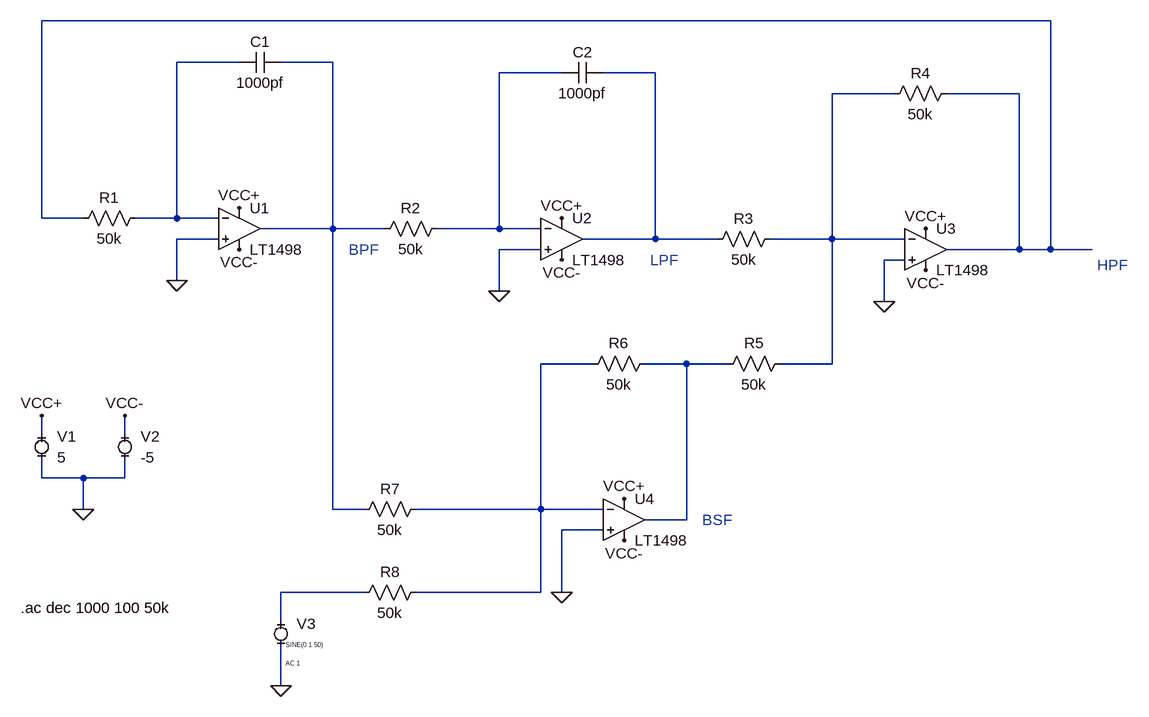
[diagram p0: schematic UniversalAmplifier.asc]
UniversalAmplifier.asc, the LTspice schematic file:
Version 4
SHEET 1 1160 1352
WIRE 1040 160 -512 160
WIRE -208 224 -304 224
WIRE -64 224 -144 224
WIRE 288 240 192 240
WIRE 432 240 352 240
WIRE 800 272 704 272
WIRE 992 272 880 272
WIRE -512 464 -512 160
WIRE -448 464 -512 464
WIRE -304 464 -304 224
WIRE -304 464 -368 464
WIRE -240 464 -304 464
WIRE -64 480 -64 224
WIRE -64 480 -176 480
WIRE 16 480 -64 480
WIRE 192 480 192 240
WIRE 192 480 96 480
WIRE 256 480 192 480
WIRE -240 496 -304 496
WIRE 432 496 432 240
WIRE 432 496 320 496
WIRE 528 496 432 496
WIRE 704 496 704 272
WIRE 704 496 608 496
WIRE 816 496 704 496
WIRE 256 512 192 512
WIRE 992 512 992 272
WIRE 992 512 880 512
WIRE 1040 512 1040 160
WIRE 1040 512 992 512
WIRE 1104 512 1040 512
WIRE 816 528 784 528
WIRE -304 560 -304 496
WIRE 192 576 192 512
WIRE 784 592 784 528
WIRE 336 688 256 688
WIRE 480 688 416 688
WIRE 544 688 480 688
WIRE 704 688 704 496
WIRE 704 688 624 688
WIRE -512 800 -512 768
WIRE -384 800 -384 768
WIRE -512 864 -512 832
WIRE -448 864 -512 864
WIRE -384 864 -384 832
WIRE -384 864 -448 864
WIRE -448 912 -448 864
WIRE -64 912 -64 480
WIRE -16 912 -64 912
WIRE 256 912 256 688
WIRE 256 912 64 912
WIRE 352 912 256 912
WIRE 480 928 480 688
WIRE 480 928 416 928
WIRE 352 944 288 944
WIRE -16 1040 -144 1040
WIRE 256 1040 256 912
WIRE 256 1040 64 1040
WIRE 288 1040 288 944
WIRE -144 1088 -144 1040
WIRE -144 1184 -144 1120
FLAG -304 560 0
FLAG 288 1040 0
FLAG 784 592 0
FLAG 192 576 0
FLAG -448 912 0
FLAG -512 768 VCC+
FLAG -384 768 VCC-
FLAG -208 512 VCC-
FLAG 288 528 VCC-
FLAG 848 544 VCC-
FLAG 384 960 VCC-
FLAG -208 448 VCC+
FLAG 288 464 VCC+
FLAG 848 480 VCC+
FLAG 384 896 VCC+
FLAG -144 1184 0
SYMBOL res -352 448 R90
WINDOW 0 0 56 VBottom 2
WINDOW 3 32 56 VTop 2
SYMATTR InstName R1
SYMATTR Value 50k
SYMBOL res 112 464 R90
WINDOW 0 0 56 VBottom 2
WINDOW 3 32 56 VTop 2
SYMATTR InstName R2
SYMATTR Value 50k
SYMBOL res 624 480 R90
WINDOW 0 0 56 VBottom 2
WINDOW 3 32 56 VTop 2
SYMATTR InstName R3
SYMATTR Value 50k
SYMBOL res 896 256 R90
WINDOW 0 0 56 VBottom 2
WINDOW 3 32 56 VTop 2
SYMATTR InstName R4
SYMATTR Value 50k
SYMBOL res 640 672 R90
WINDOW 0 0 56 VBottom 2
WINDOW 3 32 56 VTop 2
SYMATTR InstName R5
SYMATTR Value 50k
SYMBOL res 432 672 R90
WINDOW 0 0 56 VBottom 2
WINDOW 3 32 56 VTop 2
SYMATTR InstName R6
SYMATTR Value 50k
SYMBOL res 80 896 R90
WINDOW 0 0 56 VBottom 2
WINDOW 3 32 56 VTop 2
SYMATTR InstName R7
SYMATTR Value 50k
SYMBOL res 80 1024 R90
WINDOW 0 0 56 VBottom 2
WINDOW 3 32 56 VTop 2
SYMATTR InstName R8
SYMATTR Value 50k
SYMBOL cap -144 208 R90
WINDOW 0 0 32 VBottom 2
WINDOW 3 32 32 VTop 2
SYMATTR InstName C1
SYMATTR Value 1000pf
SYMBOL cap 352 224 R90
WINDOW 0 0 32 VBottom 2
WINDOW 3 32 32 VTop 2
SYMATTR InstName C2
SYMATTR Value 1000pf
SYMBOL MiniSyms4\\voltage- -512 816 R0
WINDOW 123 0 0 Left 0
WINDOW 39 0 0 Left 0
SYMATTR InstName V1
SYMATTR Value 5
SYMBOL MiniSyms4\\voltage- -384 816 R0
WINDOW 123 0 0 Left 0
WINDOW 39 0 0 Left 0
SYMATTR InstName V2
SYMATTR Value -5
SYMBOL Opamps\\LT1498 -208 416 R0
SYMATTR InstName U1
SYMBOL Opamps\\LT1498 288 432 R0
SYMATTR InstName U2
SYMBOL Opamps\\LT1498 848 448 R0
SYMATTR InstName U3
SYMBOL Opamps\\LT1498 384 864 R0
SYMATTR InstName U4
SYMBOL MiniSyms4\\voltage- -144 1104 R0
WINDOW 3 7 17 Left 0
WINDOW 123 7 45 Left 0
WINDOW 39 0 0 Left 0
SYMATTR Value SINE(0 1 50)
SYMATTR Value2 AC 1
SYMATTR InstName V3
TEXT -40 512 Left 2 ;BPF
TEXT 424 528 Left 2 ;LPF
TEXT 1112 536 Left 2 ;HPF
TEXT 504 928 Left 2 ;BSF
TEXT -544 1064 Left 2 !.ac dec 1000 100 50k

The netlist it stands for:
* UniversalAmplifier.asc
R1 N002 N001 50k
R2 N004 N003 50k
R3 N006 N005 50k
R4 N001 N006 50k
R5 N006 N008 50k
R6 N008 N007 50k
R7 N007 N003 50k
R8 N007 N009 50k
C1 N003 N002 1000pf
C2 N005 N004 1000pf
V1 VCC+ 0 5
V2 VCC- 0 -5
XU1 0 N002 VCC+ VCC- N003 LT1498  ; pins In+ In- V+ V- OUT
XU2 0 N004 VCC+ VCC- N005 LT1498  ; pins In+ In- V+ V- OUT
XU3 0 N006 VCC+ VCC- N001 LT1498  ; pins In+ In- V+ V- OUT
XU4 0 N007 VCC+ VCC- N008 LT1498  ; pins In+ In- V+ V- OUT
V3 N009 0 SINE(0 1 50) AC 1
* BPF
* LPF
* HPF
* BSF
.ac dec 1000 100 50k
.lib LTC.lib
.backanno
.end